# Altium schematic sheet MAIN.SchDoc
size A4
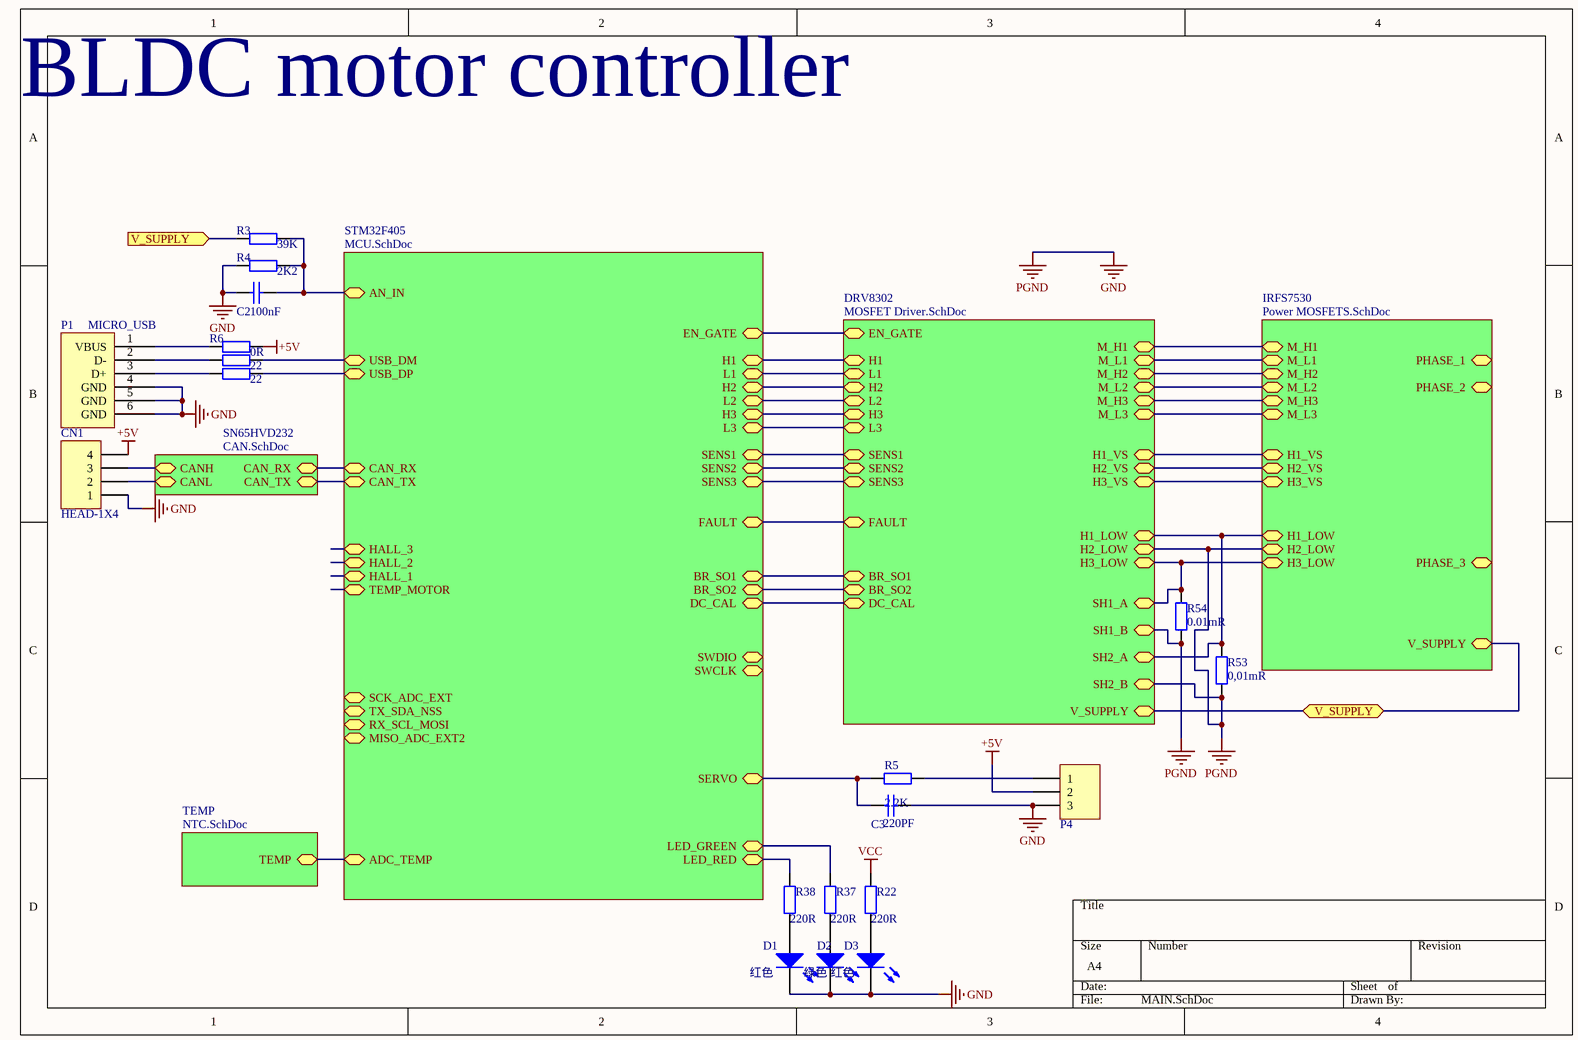
[diagram p0: MAIN.SchDoc]

## Parts
C2  value 100nF  [C-0603]  (hidden comment: CAP)
C3  220PF  [C-0603]
CN1  HEAD-1X4  [H-1X4]
D1  红色  [LED0603]
D2  绿色  [LED0603]
D3  红色  [LED0603]
P1  MICRO_USB  [MicroUSB]
P4  Header 3  [HDR3X1_A]  (value not drawn)
R3  39K  [0402]
R4  value 2K2  [0402]  (hidden comment: 2.2K)
R5  2.2K  [0402]
R6  0R  [0603-2]
R14  value 22  [LC-0402]  (hidden comment: 22R)
R15  value 22  [LC-0402]  (hidden comment: 22R)
R22  220R  [0402]
R37  220R  [0402]
R38  220R  [0402]
R53  value 0,01mR  [2512]  (hidden comment: 0.001R)
R54  value 0.01mR  [2512]  (hidden comment: 0.001R)

## Sub-sheets
DRV8302 = MOSFET Driver.SchDoc: DC_CAL, BR_SO2, BR_SO1, FAULT, SENS3, SENS2, SENS1, L3, H3, L2, H2, L1, H1, EN_GATE, M_H1, M_L1, M_H2, M_L2, M_H3, M_L3, H1_VS, H2_VS, H3_VS, H1_LOW, H2_LOW, H3_LOW, SH1_A, SH1_B, SH2_A, SH2_B, V_SUPPLY
IRFS7530 = Power MOSFETS.SchDoc: M_H1, M_L1, M_H2, M_L2, M_H3, M_L3, H1_VS, H2_VS, H3_VS, H1_LOW, H2_LOW, H3_LOW, PHASE_3, PHASE_2, PHASE_1, V_SUPPLY
SN65HVD232 = CAN.SchDoc: CANH, CANL, CAN_TX, CAN_RX
STM32F405 = MCU.SchDoc: AN_IN, USB_DM, USB_DP, CAN_RX, CAN_TX, HALL_3, HALL_2, HALL_1, TEMP_MOTOR, SCK_ADC_EXT, TX_SDA_NSS, RX_SCL_MOSI, MISO_ADC_EXT2, ADC_TEMP, EN_GATE, H1, L1, L2, H2, H3, L3, SENS1, SENS2, SENS3, FAULT, BR_SO1, BR_SO2, DC_CAL, SERVO, LED_GREEN, LED_RED, SWDIO, SWCLK
TEMP = NTC.SchDoc: TEMP

## Ports
V_SUPPLY, V_SUPPLY (in)

## Nets
+5V: CN1.4 P4.2 R6.2
GND: C2.1 C3.2 CN1.1 D1.2(K) D2.2(K) D3.2(K) P1.4(GND) P1.5(GND) P1.6(GND) P4.3 R4.1 R53.2 R54.2 ; sheet DRV8302/H2_LOW, sheet DRV8302/SH1_B, sheet DRV8302/SH2_B, sheet IRFS7530/H2_LOW  [also labelled PGND]
VCC: R22.2
V_SUPPLY: R3.1 ; port V_SUPPLY, sheet DRV8302/V_SUPPLY, sheet IRFS7530/V_SUPPLY
NetC2_2: C2.2 R3.2 R4.2 ; sheet STM32F405/AN_IN
NetC3_1: C3.1 R5.1 ; sheet STM32F405/SERVO
NetCN1_2: CN1.2 ; sheet SN65HVD232/CANL
NetCN1_3: CN1.3 ; sheet SN65HVD232/CANH
NetD1_1: D1.1(A) R38.1
NetD2_1: D2.1(A) R37.1
NetD3_1: D3.1(A) R22.1
NetP1_1: P1.1(VBUS) R6.1
NetP1_2: P1.2(D-) R14.1
NetP1_3: P1.3(D+) R15.1
NetP4_1: P4.1 R5.2
NetR14_2: R14.2 ; sheet STM32F405/USB_DM
NetR15_2: R15.2 ; sheet STM32F405/USB_DP
NetR37_2: R37.2 ; sheet STM32F405/LED_GREEN
NetR38_2: R38.2 ; sheet STM32F405/LED_RED
NetR53_1: R53.1 ; sheet DRV8302/H1_LOW, sheet DRV8302/SH2_A, sheet IRFS7530/H1_LOW
NetR54_1: R54.1 ; sheet DRV8302/H3_LOW, sheet DRV8302/SH1_A, sheet IRFS7530/H3_LOW
(unnamed): sheet STM32F405/CAN_RX, sheet SN65HVD232/CAN_RX
(unnamed): sheet STM32F405/CAN_TX, sheet SN65HVD232/CAN_TX
(unnamed): sheet STM32F405/ADC_TEMP, sheet TEMP/TEMP
(unnamed): sheet STM32F405/EN_GATE, sheet DRV8302/EN_GATE
(unnamed): sheet STM32F405/H1, sheet DRV8302/H1
(unnamed): sheet STM32F405/L1, sheet DRV8302/L1
(unnamed): sheet STM32F405/L2, sheet DRV8302/L2
(unnamed): sheet STM32F405/H2, sheet DRV8302/H2
(unnamed): sheet STM32F405/H3, sheet DRV8302/H3
(unnamed): sheet STM32F405/L3, sheet DRV8302/L3
(unnamed): sheet STM32F405/SENS1, sheet DRV8302/SENS1
(unnamed): sheet STM32F405/SENS2, sheet DRV8302/SENS2
(unnamed): sheet STM32F405/SENS3, sheet DRV8302/SENS3
(unnamed): sheet STM32F405/FAULT, sheet DRV8302/FAULT
(unnamed): sheet STM32F405/BR_SO1, sheet DRV8302/BR_SO1
(unnamed): sheet STM32F405/BR_SO2, sheet DRV8302/BR_SO2
(unnamed): sheet STM32F405/DC_CAL, sheet DRV8302/DC_CAL
(unnamed): sheet DRV8302/M_H1, sheet IRFS7530/M_H1
(unnamed): sheet DRV8302/M_L1, sheet IRFS7530/M_L1
(unnamed): sheet DRV8302/M_H2, sheet IRFS7530/M_H2
(unnamed): sheet DRV8302/M_L2, sheet IRFS7530/M_L2
(unnamed): sheet DRV8302/M_H3, sheet IRFS7530/M_H3
(unnamed): sheet DRV8302/M_L3, sheet IRFS7530/M_L3
(unnamed): sheet DRV8302/H1_VS, sheet IRFS7530/H1_VS
(unnamed): sheet DRV8302/H2_VS, sheet IRFS7530/H2_VS
(unnamed): sheet DRV8302/H3_VS, sheet IRFS7530/H3_VS

## Notes on the sheet
- BLDC motor controller

## Library data of the parts
C2 = CAP: Capacitor; Published: 8-Jun-2000; Revision: July-2002: Re-released for DXP Platform.; Publisher: Altium Limited
C3 = CAP: Capacitor; Value: 100nF; Published: 8-Jun-2000; Revision: July-2002: Re-released for DXP Platform.; Publisher: Altium Limited
CN1 = HEAD-1X4: Header, 4-Pin; LatestRevisionDate: 17-Jul-2002; LatestRevisionNote: Re-released for DXP Platform.; Publisher: Altium Limited
D1-D3 = LED2: Typical RED, GREEN, YELLOW, AMBER GaAs LED; Published: 8-Jun-2000; LatestRevisionDate: 17-Jul-2002; LatestRevisionNote: Re-released for DXP Platform.; PackageVersion: Feb-2002; PackageReference: 3.2X1.6X1.1; Publisher: Altium Limited
P1 = MINI_USB: pin to pad: 6>0
P4 = Header 3_1: 接插件; LatestRevisionDate: 17-Jul-2002; LatestRevisionNote: Re-released for DXP Platform.; Publisher: Altium Limited
R3 R4 R6 R14 R15 R53 R54 = Res1: 贴片电阻; Published: 8-Jun-2000; LatestRevisionDate: 17-Jul-2002; LatestRevisionNote: Re-released for DXP Platform.; PackageReference: AXIAL-0.4; Publisher: Altium Limited
  R3: Value: 39K
  R6: Value: 0R
R5 R22 = Res1: 贴片电阻; Value: 2k2; Published: 8-Jun-2000; LatestRevisionDate: 17-Jul-2002; LatestRevisionNote: Re-released for DXP Platform.; PackageReference: AXIAL-0.4; Publisher: Altium Limited
R37 R38 = Res1: 贴片电阻; Value: 220; Published: 8-Jun-2000; LatestRevisionDate: 17-Jul-2002; LatestRevisionNote: Re-released for DXP Platform.; PackageReference: AXIAL-0.4; Publisher: Altium Limited